# EAGLE design KammsensorV2 (EAGLE 7.7.0)
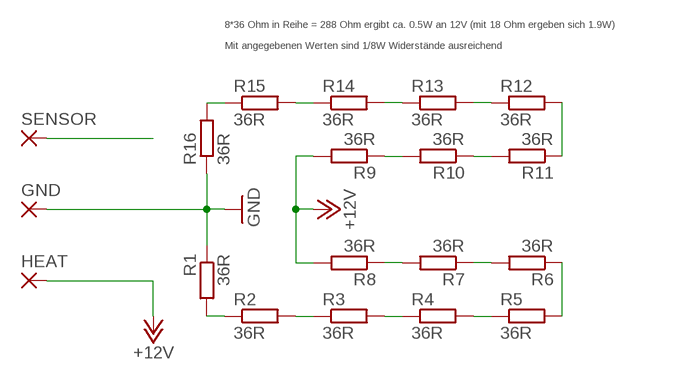
[diagram p0: schematic, sheet 1]

## Parts
GND  WIREPADSMD5-1,8  [5-1,8]
HEAT  WIREPADSMD5-1,8  [5-1,8]
R1  36R  R-EU_M1206  [M1206]
R2  36R  R-EU_M1206  [M1206]
R3  36R  R-EU_M1206  [M1206]
R4  36R  R-EU_M1206  [M1206]
R5  36R  R-EU_M1206  [M1206]
R6  36R  R-EU_M1206  [M1206]
R7  36R  R-EU_M1206  [M1206]
R8  36R  R-EU_M1206  [M1206]
R9  36R  R-EU_M1206  [M1206]
R10  36R  R-EU_M1206  [M1206]
R11  36R  R-EU_M1206  [M1206]
R12  36R  R-EU_M1206  [M1206]
R13  36R  R-EU_M1206  [M1206]
R14  36R  R-EU_M1206  [M1206]
R15  36R  R-EU_M1206  [M1206]
R16  36R  R-EU_M1206  [M1206]
SENSOR  WIREPADSMD5-1,8  [5-1,8]

## Nets
+12V: HEAT.1(P) R8.2 R9.2
GND: GND.1(P) R1.1 R16.1
N$1: R3.2 R4.1
N$2: R2.2 R3.1
N$3: R14.1 R15.2
N$4: R4.2 R5.1
N$5: R5.2 R6.1
N$6: R6.2 R7.1
N$7: R1.2 R2.1
N$8: R7.2 R8.1
N$9: R9.1 R10.2
N$11: R10.1 R11.2
N$12: R11.1 R12.2
N$13: R12.1 R13.2
N$14: R13.1 R14.2
N$15: R15.1 R16.2
SENSOR: SENSOR.1(P)

## Notes on the sheet
- 8*36 Ohm in Reihe = 288 Ohm ergibt ca. 0.5W an 12V (mit 18 Ohm ergeben sich 1.9W)
  
  Mit angegebenen Werten sind 1/8W Widerstände ausreichend

## Library data of the parts
GND HEAT SENSOR = wirepad:WIREPAD: Wire PAD connect wire on PCB
R1-R16 = rcl:R-EU_: RESISTOR, European symbol

## Net classes
0 default: width 0.305 mm
1 PWR: width 0.61 mm

## Board
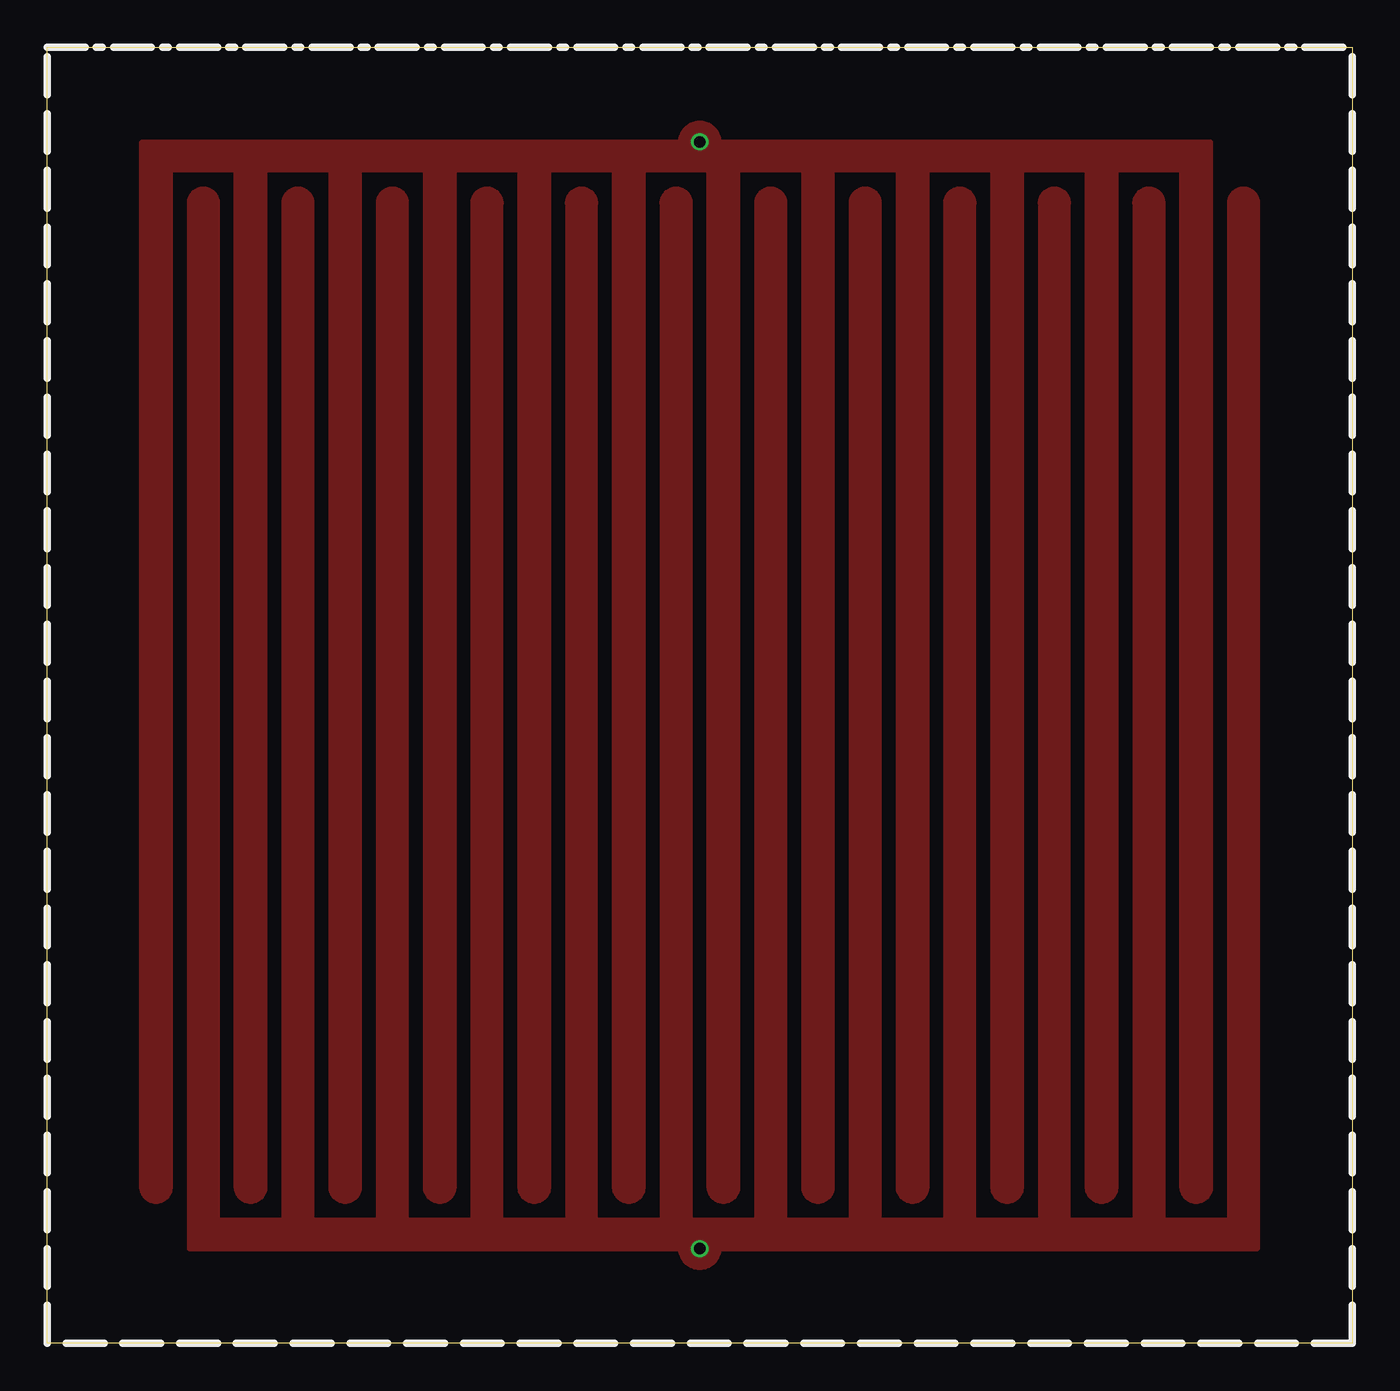
[diagram p1: board, top side]
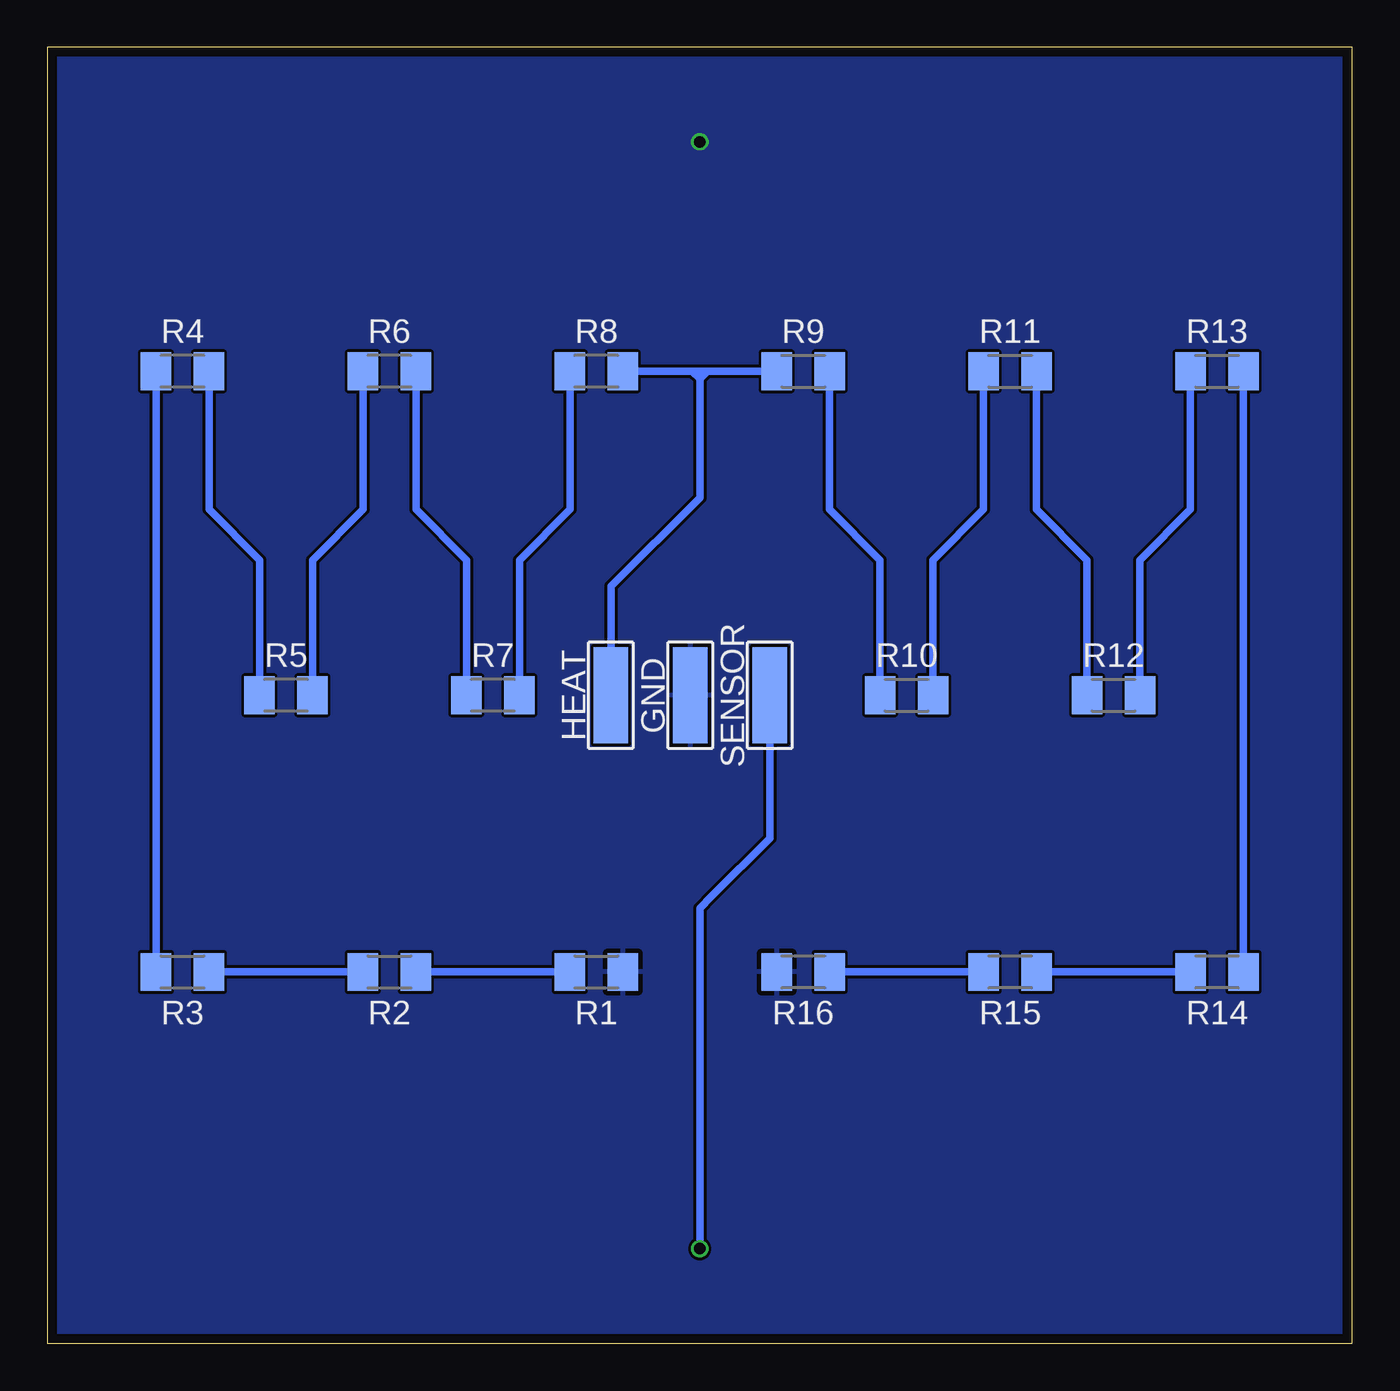
[diagram p2: board, bottom side, seen from below]

Size 69 x 68.5 mm. Coordinates in mm from the lower left corner, seen from the top.
Outline: 0,0 0,68.5 69,68.5 69,0 0,0
Copper layers (1*16): Top 0.035mm / dielectric 1.6mm / Bottom 0.035mm
Design rules "Elecrow": minimum track width 6mil, minimum drill 12mil, track to track 6mil, track to pad 6mil, pad to pad 6mil, via to via 8mil, smd to smd 0mil, copper to edge 20mil, drill to drill 10mil, minimum pad ring 6mil, minimum via ring 6mil, stop-mask expansion 0mil, vias tented up to drill 100mil, thermal gap 10mil

### Footprints (pad centres in the part's own frame; a part is rotated, then mirrored left to right if it is on the bottom)
5-1,8 = smd 1.829 x 5.08: 1 0,0
M1206 = smd 1.6 x 2: 1 -1.4,0; 2 1.4,0

### Placement (x,y rotation side)
GND  35,34.25 0 bottom
HEAT  39.2,34.25 0 bottom
R1  39.97,19.62 180 bottom
R2  50.91,19.62 180 bottom
R3  61.85,19.62 180 bottom
R4  61.85,51.38 0 bottom
R5  56.38,34.25 0 bottom
R6  50.91,51.38 0 bottom
R7  45.44,34.25 0 bottom
R8  39.97,51.38 0 bottom
R9  29.03,51.38 180 bottom
R10  23.56,34.25 180 bottom
R11  18.09,51.38 180 bottom
R12  12.62,34.25 180 bottom
R13  7.15,51.38 180 bottom
R14  7.15,19.62 0 bottom
R15  18.09,19.62 0 bottom
R16  29.03,19.62 0 bottom
SENSOR  30.8,34.25 0 bottom

### Tracks (layer width: path | path; a pad name or v marks a point on that pad's centre or on a via)
+12V
  Bottom 0.406: R9.2 34.09,51.38 | 34.09,51.38 34.91,51.38 | HEAT.1 39.2,40 34.5,44.7 34.5,50.97 | 34.5,50.97 34.91,51.38 | 34.91,51.38 R8.2 | 34.5,50.97 34.09,51.38
GND  (via drill 0.6)
  other vias: 34.5,63.5
  pour Top (rank 5): 5,8.25 5,63.5 61.5,63.5 61.5,8.25 arc-180 60,8.25 60,62 56.5,62 56.5,8.25 arc-180 55,8.25 55,62 51.5,62 51.5,8.25 arc-180 50,8.25 50,62 46.5,62 46.5,8.25 arc-180 45,8.25 45,62 41.5,62 41.5,8.25 arc-180 40,8.25 40,62 36.5,62 36.5,8.25 arc-180 35,8.25 35,62 31.5,62 31.5,8.25 arc-180 30,8.25 30,62 26.5,62 26.5,8.25 arc-180 25,8.25 25,62 21.5,62 21.5,8.25 arc-180 20,8.25 20,62 16.5,62 16.5,8.25 arc-180 15,8.25 15,62 11.5,62 11.5,8.25 arc-180 10,8.25 10,62 6.5,62 6.5,8.25 arc-180
  pour Top (rank 5): 33.5,63.5 arc-180 35.5,63.5 arc-180
  pour Bottom (rank 5): 0,68.5 69,68.5 69,0 0,0
N$1
  Bottom 0.406: R3.2 R4.1
N$2
  Bottom 0.406: R3.1 R2.2
N$3
  Bottom 0.406: R14.1 R15.2
N$4
  Bottom 0.406: R4.2 60.45,44.07 57.78,41.4 R5.1
N$5
  Bottom 0.406: R6.1 52.31,44.07 54.98,41.4 R5.2
N$6
  Bottom 0.406: R6.2 49.51,44.07 46.84,41.4 R7.1
N$7
  Bottom 0.406: R2.1 R1.2
N$8
  Bottom 0.406: R8.1 41.37,44.07 44.04,41.4 R7.2
N$9
  Bottom 0.406: R9.1 27.63,44.07 24.96,41.4 R10.2
N$11
  Bottom 0.406: R11.2 19.49,44.07 22.16,41.4 R10.1
N$12
  Bottom 0.406: R11.1 16.69,44.07 14.02,41.4 R12.2
N$13
  Bottom 0.406: R13.2 8.55,44.07 11.22,41.4 R12.1
N$14
  Bottom 0.406: R14.2 R13.1
N$15
  Bottom 0.406: R15.1 R16.2
SENSOR  (via drill 0.6)
  Bottom 0.406: SENSOR.1 30.8,26.7 33.87,23.63 34.5,23 v34.5,5
  pour Top: 64,5 64,60.25 arc180 62.5,60.25 62.5,6.5 59,6.5 59,60.25 arc180 57.5,60.25 57.5,6.5 54,6.5 54,60.25 arc180 52.5,60.25 52.5,6.5 49,6.5 49,60.25 arc180 47.5,60.25 47.5,6.5 44,6.5 44,60.25 arc180 42.5,60.25 42.5,6.5 39,6.5 39,60.25 arc180 37.5,60.25 37.5,6.5 34,6.5 34,60.25 arc180 32.5,60.25 32.5,6.5 29,6.5 29,60.25 arc180 27.5,60.25 27.5,6.5 24,6.5 24,60.25 arc180 22.5,60.25 22.5,6.5 19,6.5 19,60.25 arc180 17.5,60.25 17.5,6.5 14,6.5 14,60.25 arc180 12.5,60.25 12.5,6.5 9,6.5 9,60.25 arc180 7.5,60.25 7.5,5
  pour Top (no thermals): 33.5,5 arc-180 35.5,5 arc-180